# EAGLE design lpc812_breakout (EAGLE 7.1.0)
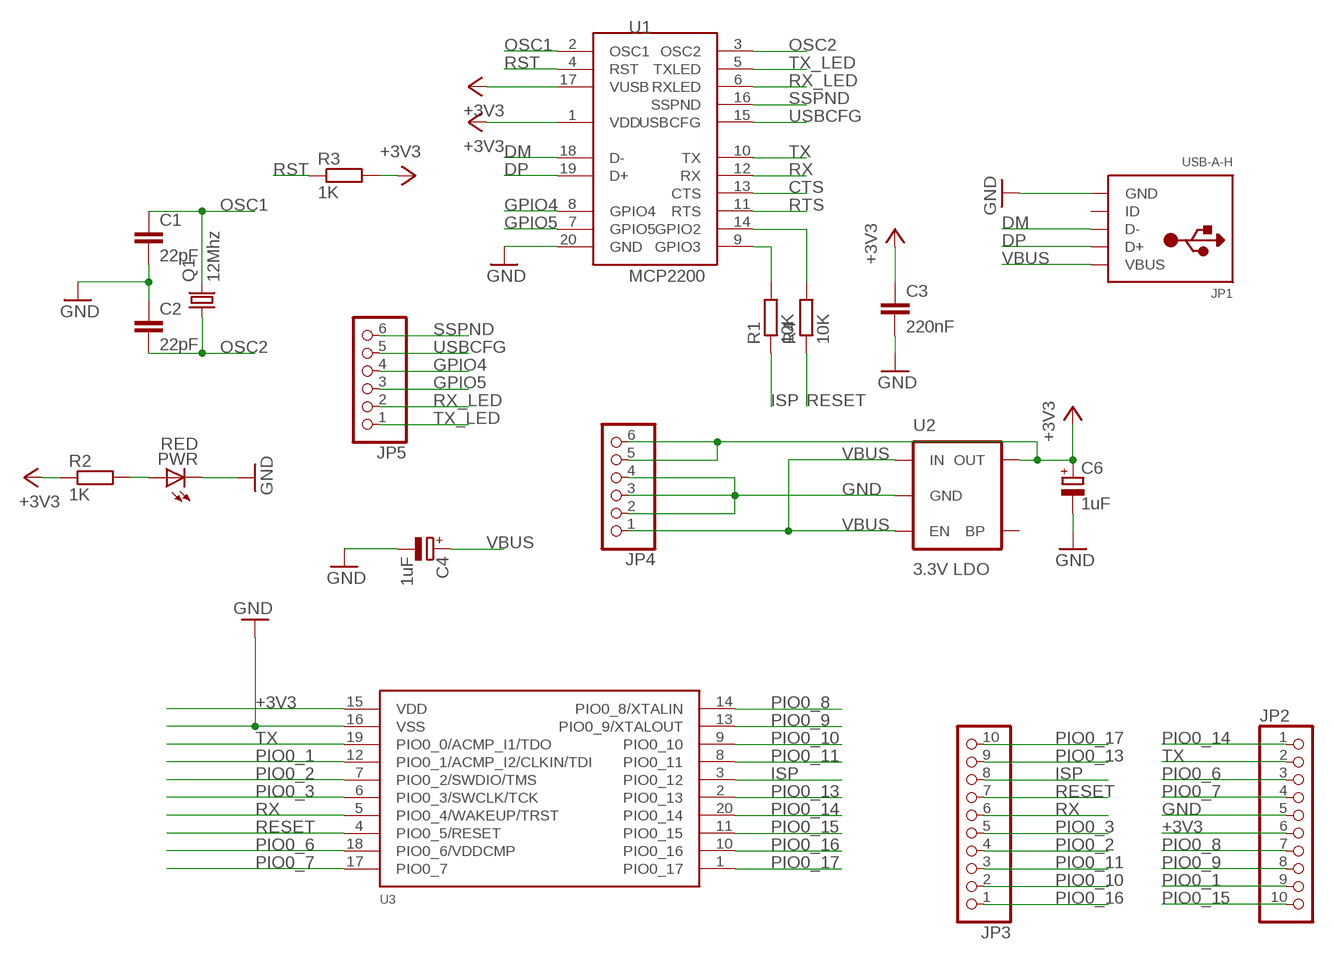
[diagram p0: schematic, sheet 1]

## Parts
C1  22pF  C-EUC1206  [C1206]
C2  22pF  C-EUC1206  [C1206]
C3  220nF  C-EUC1206  [C1206]
C4  1uF  CPOL-EUA/3216-18R  [A/3216-18R]
C6  1uF  CPOL-EUA/3216-18R  [A/3216-18R]
JP1  USB-A-H  USBMOLEX  [USB-MINIB-THM-MOLEX]
JP2  HEADER-1X10ROUND  [1X10_ROUND]
JP3  HEADER-1X10ROUND  [1X10_ROUND]
JP4  HEADER-1X6ROUND  [1X06_ROUND]
JP5  HEADER-1X6ROUND  [1X06_ROUND]
PWR  RED  LEDSMT1206  [1206]
Q1  12Mhz  CRYSTALHC49S  [HC49/S]
R1  10K  R-EU_R1206  [R1206]
R2  1K  R-EU_R1206  [R1206]
R3  1K  R-EU_R1206  [R1206]
R4  10K  R-EU_R1206  [R1206]
U1  MCP2200  [SSOP20]
U2  3.3V LDO  V_REG_LDOSMD  [SOT23-5]
U3  LPC812M101JDH20  [TSSOP20]

## Nets
+3V3: C3.1 C6.+ JP2.6 JP4.5 JP4.6 R2.1 R3.2 U1.1(VDD) U1.17(VUSB) U2.5(OUT) U3.15(VDD)
CTS: U1.13(CTS)
DM: JP1.D- U1.18(D-)
DP: JP1.D+ U1.19(D+)
GND [ground]: C1.2 C2.1 C3.2 C4.- C6.- JP1.GND JP2.5 JP4.2 JP4.3 JP4.4 PWR.C U1.20(GND) U2.2(GND) U3.16(VSS)
GPIO4: JP5.4 U1.8(GPIO4)
GPIO5: JP5.3 U1.7(GPIO5)
ISP: JP3.8 R1.1 U3.3(PIO0_12)
N$1: PWR.A R2.2
N$2: R1.2 U1.9(GPIO3)
N$3: R4.2 U1.14(GPIO2)
OSC1: C1.1 Q1.2 U1.2(OSC1)
OSC2: C2.2 Q1.1 U1.3(OSC2)
PIO0_1: JP2.9 U3.12(PIO0_1/ACMP_I2/CLKIN/TDI)
PIO0_2: JP3.4 U3.7(PIO0_2/SWDIO/TMS)
PIO0_3: JP3.5 U3.6(PIO0_3/SWCLK/TCK)
PIO0_6: JP2.3 U3.18(PIO0_6/VDDCMP)
PIO0_7: JP2.4 U3.17(PIO0_7)
PIO0_8: JP2.7 U3.14(PIO0_8/XTALIN)
PIO0_9: JP2.8 U3.13(PIO0_9/XTALOUT)
PIO0_10: JP3.2 U3.9(PIO0_10)
PIO0_11: JP3.3 U3.8(PIO0_11)
PIO0_13: JP3.9 U3.2(PIO0_13)
PIO0_14: JP2.1 U3.20(PIO0_14)
PIO0_15: JP2.10 U3.11(PIO0_15)
PIO0_16: JP3.1 U3.10(PIO0_16)
PIO0_17: JP3.10 U3.1(PIO0_17)
RESET: JP3.7 R4.1 U3.4(PIO0_5/RESET)
RST: R3.1 U1.4(RST)
RTS: U1.11(RTS)
RX: JP3.6 U1.12(RX) U3.5(PIO0_4/WAKEUP/TRST)
RX_LED: JP5.2 U1.6(RXLED)
SSPND: JP5.6 U1.16(SSPND)
TX: JP2.2 U1.10(TX) U3.19(PIO0_0/ACMP_I1/TDO)
TX_LED: JP5.1 U1.5(TXLED)
USBCFG: JP5.5 U1.15(USBCFG)
VBUS: C4.+ JP1.VBUS JP4.1 U2.1(IN) U2.3(EN)
Unconnected: JP1.ID U2.4(BP)

## Library data of the parts
C1-C3 = rcl:C-EU: CAPACITOR, European symbol
C4 C6 = rcl:CPOL-EU: POLARIZED CAPACITOR, European symbol
JP1 = adafruit:USB: USB Connectors USBMINIB - Surface Mount Female Mini-B USB Connector 4UConnector: 06564 By microbuilder.eu Thru-hole RA Female Mini-B USB Connector 4UConnector: 18732 By ladyada.net
JP2 JP3 = microbuilder:HEADER-1X10: PIN HEADER
JP4 JP5 = microbuilder:HEADER-1X6: PIN HEADER
PWR = led:LED: LED OSRAM: - CHIPLED LG R971, LG N971, LY N971, LG Q971, LY Q971, LO R971, LY R971 LH N974, LH R974 LS Q976, LO Q976, LY Q976 LO Q996 - Hyper CHIPLED LW Q18S LB Q993, LB Q99A, LB R99A - SideLED LS A670, LO A670, LY A670, LG A670, LP A670 LB A673, LV A673, LT A673, LW A673 LH A674 LY A675 LS A676, LA A676, LO A676, LY A676, LW A676 LS A679, LY A679, LG A679 - Hyper Micro SIDELED® LS Y876, LA Y876, LO Y876, LY Y876 LT Y87S - SmartLED LW L88C, LW L88S LB L89C, LB L89S, LG L890 LS L89K, LO L89K, LY L89K LS L896, LA L896, LO L896, LY L896 - TOPLED LS T670, LO T670, LY T670, LG T670, LP T670 LSG T670, LSP T670, LSY T670, LOP T670, LYG T670 LG T671, LOG T671, LSG T671 LB T673, LV T673, LT T673, LW T673 LH T674 LS T676, LA T676, LO T676, LY T676, LB T676, LH T676, LSB T676, LW T676 LB T67C, LV T67C, LT T67C, LS T67K, LO T67K, LY T67K, LW E67C LS E67B, LA E67B, LO E67B, LY E67B, LB E67C, LV E67C, LT E67C LW T67C LS T679, LY T679, LG T679 LS T770, LO T770, LY T770, LG T770, LP T770 LB T773, LV T773, LT T773, LW T773 LH T774 LS E675, LA E675, LY E675, LS T675 LS T776, LA T776, LO T776, LY T776, LB T776 LHGB T686 LT T68C, LB T68C - Hyper Mini TOPLED® LB M676 - Mini TOPLED Santana® LG M470 LS M47K, LO M47K, LY M47K Source: http://www.osram.convergy.de LUXEON: - LUMILED® LXK2-PW12-R00, LXK2-PW12-S00, LXK2-PW14-U00, LXK2-PW14-V00 LXK2-PM12-R00, LXK2-PM12-S00, LXK2-PM14-U00 LXK2-PE12-Q00, LXK2-PE12-R00, LXK2-PE12-S00, LXK2-PE14-T00, LXK2-PE14-U00 LXK2-PB12-K00, LXK2-PB12-L00, LXK2-PB12-M00, LXK2-PB14-N00, LXK2-PB14-P00, LXK2-PB14-Q00 LXK2-PR12-L00, LXK2-PR12-M00, LXK2-PR14-Q00, LXK2-PR14-R00 LXK2-PD12-Q00, LXK2-PD12-R00, LXK2-PD12-S00 LXK2-PH12-R00, LXK2-PH12-S00 LXK2-PL12-P00, LXK2-PL12-Q00, LXK2-PL12-R00 Source: www.luxeon.com KINGBRIGHT: KA-3528ASYC Source: www.kingbright.com
Q1 = adafruit:CRYSTAL: CRYSTAL; OC_FARNELL: 1667008; OC_NEWARK: unknown
R1-R4 = rcl:R-EU_: RESISTOR, European symbol
U1 = microchip-update:MCP2200: USB 2.0 to UART Protocol Converter with GPIO
U2 = SparkFun:V_REG_LDO: Voltage Regulator LDO Standard 150mA LDO voltage regulator in SOT-23 layout. Micrel part MIC5205. BP (by-pass) pin is used to lower output noise with 470pF cap.
U3 = LPC800:LPC812M101JDH20

## Net classes
0 default: width 0.305 mm, clearance 0.205 mm
1 ground: width 0.305 mm, clearance 0.205 mm to class 0, clearance 0.205 mm

## Board
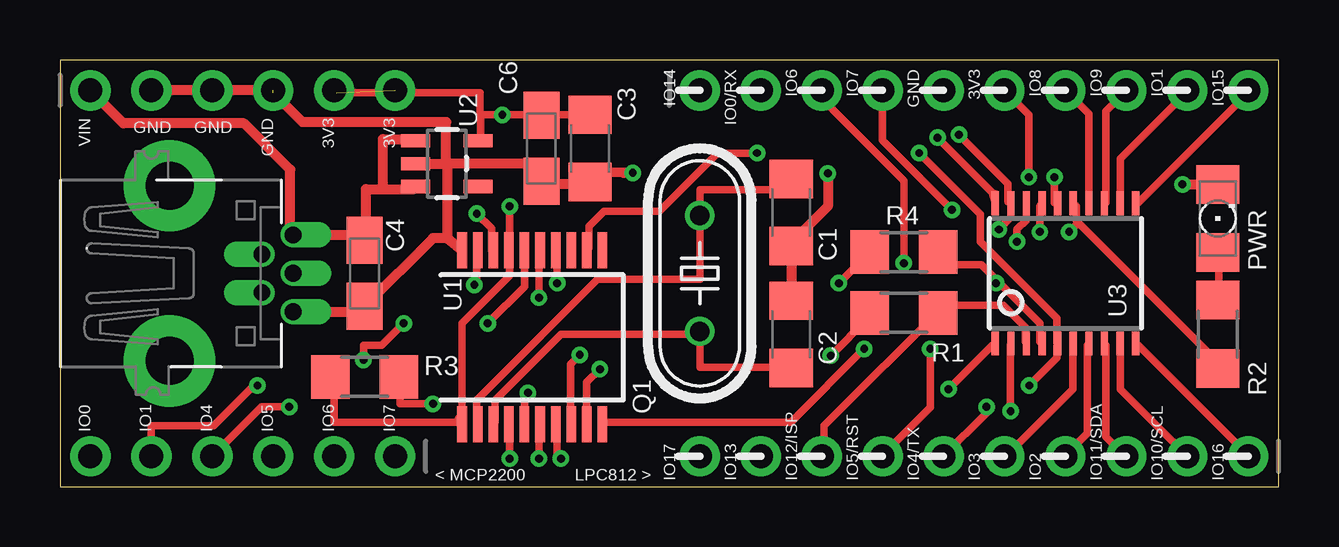
[diagram p1: board, top side]
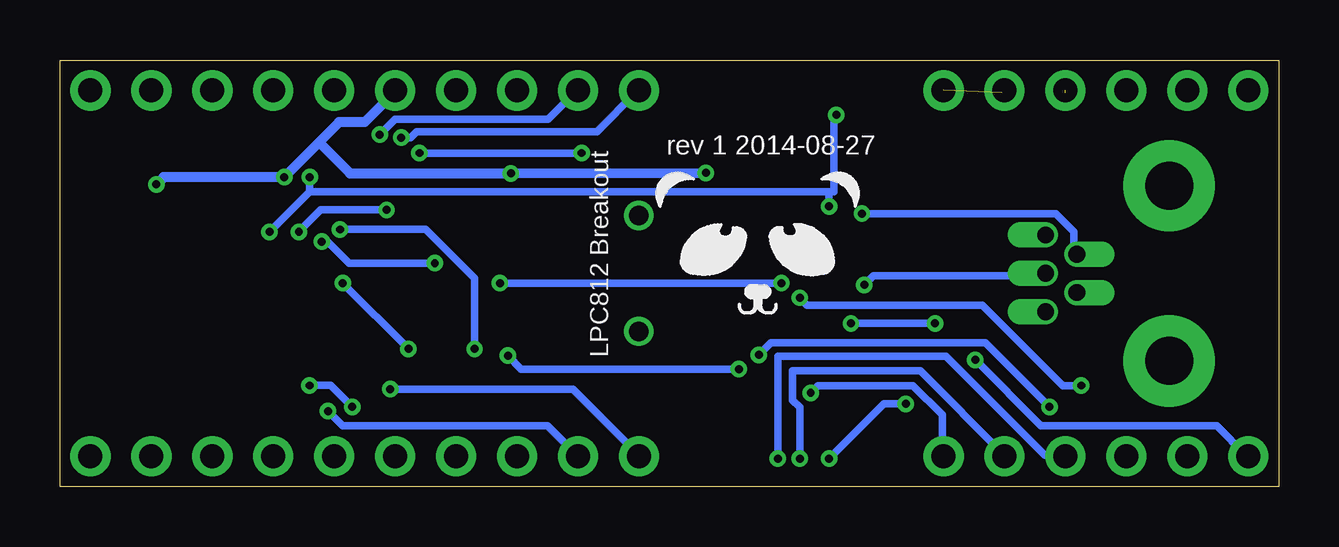
[diagram p2: board, bottom side, seen from below]

Size 50.8 x 17.78 mm. Coordinates in mm from the lower left corner, seen from the top.
Outline: 0,0 50.8,0 50.8,17.78 0,17.78 0,0
Copper layers (1*16): Top 0.0356mm / dielectric 1.5011mm / Bottom 0.0356mm
Design rules "LaenPCBOrder": minimum track width 6mil, minimum drill 13mil, track to track 6mil, track to pad 6mil, pad to pad 6mil, via to via 6mil, smd to smd 6mil, copper to edge 15mil, drill to drill 6mil, minimum pad ring 7mil, minimum via ring 7mil, stop-mask expansion 3mil, vias tented up to drill 0mil, thermal gap 10mil
tRestrict: area -1.3,-5.7 to 3.8,14; area 27.2,18.1 to 48.8,20; area 27.6,-4.9 to 49.8,-0.5; area 27.6,-4.9 to 49.8,-0.5; area 27.6,-4.9 to 49.8,-0.5; area -6.7,-4.9 to 15.5,-0.5; area 5.1,7.6 to 7,10.2; area 5.1,7.6 to 7,10.2
bRestrict: area 0,-4.7 to 3.8,14; area 27.6,-4.9 to 49.8,-0.5; area 27.2,18.1 to 48.8,20; area -6.6,-4.9 to 15.7,-0.5; area 5.1,7.6 to 7,10.2

### Footprints (pad centres in the part's own frame; a part is rotated, then mirrored left to right if it is on the bottom)
C1206 = smd 1.6 x 1.8: 1 -1.4,0; 2 1.4,0
A/3216-18R = smd 1.95 x 1.5: + 1.375,0; - -1.375,0
USB-MINIB-THM-MOLEX = drill 0.7 offset: D+ 0,9.72; D- -0.8,8.42; GND 1.6,9.72; ID 0.8,8.42; VBUS -1.6,9.72 | drill 2 pad 3.81: GND1 -3.65,4.57; GND4 3.65,4.57
1X10_ROUND = drill 1 pad 1.676: 1 -11.43,0; 2 -8.89,0; 3 -6.35,0; 4 -3.81,0; 5 -1.27,0; 6 1.27,0; 7 3.81,0; 8 6.35,0; 9 8.89,0; 10 11.43,0
1X06_ROUND = drill 1 pad 1.676: 1 -6.35,0; 2 -3.81,0; 3 -1.27,0; 4 1.27,0; 5 3.81,0; 6 6.35,0
1206 = smd 1.6 x 1.803: A -1.422,0; C 1.422,0
HC49/S = drill 0.813: 1 -2.413,0; 2 2.413,0
R1206 = smd 1.6 x 1.803: 1 -1.422,0; 2 1.422,0
SSOP20 = smd 0.4 x 1.5: 1 -2.925,-3.625; 2 -2.275,-3.625; 3 -1.625,-3.625; 4 -0.975,-3.625; 5 -0.325,-3.625; 6 0.325,-3.625; 7 0.975,-3.625; 8 1.625,-3.625; 9 2.275,-3.625; 10 2.925,-3.625; 11 2.925,3.625; 12 2.275,3.625; 13 1.625,3.625; 14 0.975,3.625; 15 0.325,3.625; 16 -0.325,3.625; 17 -0.975,3.625; 18 -1.625,3.625; 19 -2.275,3.625; 20 -2.925,3.625
SOT23-5 = smd 0.55 x 1.2: 1 -0.95,-1.3; 2 0,-1.3; 3 0.95,-1.3; 4 0.95,1.3; 5 -0.95,1.3
TSSOP20 = smd 0.305 x 0.991: 1 -2.925,-2.918; 2 -2.275,-2.918; 3 -1.625,-2.918; 4 -0.975,-2.918; 5 -0.325,-2.918; 6 0.325,-2.918; 7 0.975,-2.918; 8 1.625,-2.918; 9 2.275,-2.918; 10 2.925,-2.918; 11 2.925,2.918; 12 2.275,2.918; 13 1.625,2.918; 14 0.975,2.918; 15 0.325,2.918; 16 -0.325,2.918; 17 -0.975,2.918; 18 -1.625,2.918; 19 -2.275,2.918; 20 -2.925,2.918

### Placement (x,y rotation side)
C1  30.48,11.43 270 top
C2  30.48,6.35 270 top
C3  22.1,14.1 270 top
C4  12.7,8.89 90 top
C6  20.07,14.1 90 top
JP1  0,8.89 270 top
JP2  38.1,16.51 0 top
JP3  38.1,1.27 180 top
JP4  7.62,16.51 0 top
JP5  7.62,1.27 180 top
PWR  48.26,11.18 90 top
Q1  26.67,8.89 90 top
R1  35.18,7.24 180 top
R2  48.26,6.35 90 top
R3  12.7,4.57 180 top
R4  35.18,9.78 180 top
U1  19.68,6.22 0 top
U2  16.13,13.46 270 top
U3  41.91,8.89 0 top
U$1  [PANDA]  21.72,9.27 0 bottom

### Tracks (layer width: path | path; a pad name or v marks a point on that pad's centre or on a via)
+3V3  (via drill 0.33)  (1 unrouted)
  Top 0.305: 48.16,4.98 R2.1 48.16,5.13 48.16,5.28 42.44,11 | U3.15 42.37,11.68 42.37,11.07 42.44,11 | 17.53,15.49 17.5,15.49 17.5,16.41 11.53,16.41 JP4.5 | 17.53,15.49 v18.44,15.49 | v18.44,15.49 | v18.44,15.49 19.96,15.49 C6.+ 20.12,15.49 C3.1 | JP2.6 40.39,15.49 v40.39,12.9 | v42.06,10.62 42.44,11 | R3.2 11.43,4.52 11.43,2.69 16.61,2.69 U1.1 16.61,2.85 16.76,3 16.76,6.81 18.75,8.79 18.75,9.7 U1.17 18.75,9.86 v18.75,11.68 | 17.53,15.49 17.53,14.43 U2.5
  Bottom 0.305: v18.44,15.49 18.59,15.49 18.54,15.37 18.54,12.29 18.75,12.29 | 40.39,12.29 v40.39,12.9 | 18.75,12.29 40.39,12.29 | 40.39,12.29 v42.06,10.62 | 18.75,12.29 v18.75,11.68
DM  (via drill 0.33)
  Top 0.305: v17.37,11.38 17.98,10.77 17.98,9.86 U1.18
  Bottom 0.305: v17.37,11.38 9.3,11.38 8.53,10.62 8.53,9.7 JP1.D-
DP  (via drill 0.33)
  Top 0.305: 17.27,8.64 v17.27,8.41 17.37,8.64 17.37,9.7 U1.19
  Bottom 0.305: v17.27,8.41 16.89,8.79 9.75,8.79 JP1.D+
GND  (via drill 0.33)  (1 unrouted)
  Top 0.305: 30.48,10.16 C1.2 | 12.8,7.57 C4.- 12.8,7.72 12.93,8 | 15.04,13.44 U2.2 14.94,13.44 | 30.63,10.16 C1.2 | 20.12,12.6 C6.- | 30.63,10.31 C1.2 | v41.45,12.9 41.45,11.84 U3.16 | 48.16,12.6 PWR.C
  Top 0.406: JP1.GND 12.47,7.29 C4.- 15.55,10.36 16.15,10.36 | 22.1,12.6 22.15,13.11 23.5,13.08 v23.88,13.08 | C1.2 C2.1 | 22.1,12.6 20.12,12.6 | 22.1,12.6 C3.2 | 30.63,10.31 32,11.68 v32,13.06 | v46.79,12.6 48.16,12.6 | 16.15,13.44 16.1,13.44 | 16.1,13.44 15.04,13.44 14.94,13.44 | 16.15,10.36 16.15,13.44 | 16.15,13.44 16.28,13.46 19.46,13.46 C6.- | 16.15,10.36 U1.20 | 8.89,16.41 10.11,15.19 16.1,15.19 16.1,13.44 | JP4.4 JP4.3 JP4.2
  Bottom 0.305: v32,13.06 | 36.88,16.41 JP2.5
  Bottom 0.406: v23.88,13.08 v32,13.06 32.54,13.06 38.71,13.06 40.01,14.35 | 40.01,14.35 39.17,15.19 38.1,15.19 36.88,16.41 | 40.01,14.35 v41.45,12.9 46.48,12.9 v46.79,12.6
GPIO4  (via drill 0.33)
  Top 0.305: v21.67,5.49 21.28,5.11 21.28,2.69 U1.8 | v9.56,3.33 8.41,3.33 6.37,1.29 JP5.4
  Bottom 0.305: v21.67,5.49 21.16,6 12.23,6 v9.56,3.33
GPIO5  (via drill 0.33)
  Top 0.305: v20.88,1.17 20.73,1.32 20.73,2.54 U1.7
  Bottom 0.305: v20.88,1.17 20.88,5.44 13.87,5.44 9.75,1.32 8.99,1.32 JP5.3
ISP
  Top 0.305: U3.3 40.23,6.05 40.23,6.66 39.32,7.57 37.03,7.57 R1.1 36.88,7.57 31.85,2.54 31.85,1.32 JP3.8
N$1
  Top 0.305: R2.2 48.31,7.87 48.31,10.01 PWR.A
N$2  (via drill 0.33)
  Top 0.305: 34.14,7.57 R1.2 33.68,7.11 33.68,7.01 v32.13,5.46 | v22.5,4.9 21.95,4.34 21.95,2.69 U1.9
  Bottom 0.305: v22.5,4.9 31.57,4.9 v32.13,5.46
N$3  (via drill 0.33)
  Top 0.305: v20.73,8.48 20.73,9.7 U1.14 | v32.46,8.48 33.68,9.7 R4.2
  Bottom 0.305: v32.46,8.48 v20.73,8.48
OSC1
  Top 0.305: C1.1 30.48,12.37 26.67,12.37 Q1.2 26.67,8.64 22.4,8.64 17.37,3.61 17.37,2.69 U1.2
OSC2
  Top 0.305: 26.67,6.35 20.88,6.35 18.14,3.61 18.14,2.69 U1.3 | 26.67,6.35 26.67,4.98 30.48,4.98 C2.2 | 26.67,6.35 Q1.1
PIO0_1
  Top 0.305: U3.12 44.2,11.84 44.2,13.66 46.94,16.41 JP2.9
PIO0_2
  Top 0.305: U3.7 42.82,5.89 42.82,2.23 41.91,1.32 JP3.4
PIO0_3
  Top 0.305: U3.6 42.22,5.89 42.22,4.06 39.47,1.32 JP3.5
PIO0_6  (via drill 0.33)
  Top 0.305: v39.89,10.21 39.89,10.72 40.27,11.1 40.27,11.74 U3.18 | v35.18,9.32 35.18,12.76 31.86,16.07 31.86,16.45 JP2.3
  Bottom 0.305: v39.89,10.21 39.64,10.21 38.74,9.32 v35.18,9.32
PIO0_7  (via drill 0.33)
  Top 0.305: v40.84,10.62 40.84,11.68 U3.17 | v37.19,11.53 34.29,14.43 JP2.4
  Bottom 0.305: v40.84,10.62 39.93,11.53 v37.19,11.53
PIO0_8
  Top 0.305: U3.14 42.88,15.54 JP2.7
PIO0_9
  Top 0.305: JP2.8 43.59,15.65 43.59,11.84 U3.13
PIO0_10
  Top 0.305: JP3.2 44.2,4.06 44.2,5.89 U3.9
PIO0_11
  Top 0.305: U3.8 43.59,5.89 43.59,2.08 44.35,1.32 JP3.3
PIO0_13  (via drill 0.33)
  Top 0.305: v39.62,3.15 39.62,5.89 U3.2
  Bottom 0.305: v39.62,3.15 39.01,2.54 30.48,2.54 JP3.9
PIO0_14  (via drill 0.33)
  Top 0.305: 38.99,12.22 U3.20 38.87,12.25 v36.58,14.54
  Bottom 0.305: v36.58,14.54 36.2,14.54 35.94,14.8 28.42,14.8 26.77,16.45 JP2.1
PIO0_15
  Top 0.305: U3.11 44.96,11.84 49.53,16.41 JP2.10
PIO0_16
  Top 0.305: U3.10 44.96,5.89 49.53,1.32 JP3.1
PIO0_17  (via drill 0.33)
  Top 0.305: v37.03,4.06 38.86,5.89 U3.1
  Bottom 0.305: v37.03,4.06 29.41,4.06 26.67,1.32 JP3.10
RESET  (via drill 0.33)
  Top 0.305: 39.09,8.56 38.41,9.25 36.73,9.25 36.73,9.7 R4.1 | 39.09,8.56 40.84,6.81 40.84,6.05 U3.4 | v36.27,5.74 36.27,3.3 34.29,1.32 JP3.7 | v39.01,8.48 39.09,8.56
  Bottom 0.305: v39.01,8.48 v36.27,5.74
RST  (via drill 0.33)
  Top 0.305: v18.75,1.17 18.75,2.54 U1.4 | v15.54,3.45 14.17,3.45 14.17,4.52 R3.1
  Bottom 0.305: v18.75,1.17 16.46,3.45 v15.54,3.45
RX  (via drill 0.33)
  Top 0.305: v40.4,4.22 41.55,5.37 41.55,5.88 U3.5 41.55,6 41.55,7.02 38.36,10.21 38.36,11.36 v35.81,13.9 | v38.62,3.33 38.62,3.07 36.83,1.29 JP3.6 | v29.06,13.9 27.4,13.9 24.98,11.48 22.69,11.48 22.05,10.85 22.05,9.95 U1.12
  Bottom 0.305: v40.4,4.22 39.51,4.22 v38.62,3.33 | v35.81,13.9 v29.06,13.9
RX_LED  (via drill 0.33)
  Top 0.305: v19.96,1.17 19.96,2.54 U1.6
  Bottom 0.305: v19.96,1.17 19.96,3.3 20.27,3.61 20.27,4.83 14.94,4.83 11.43,1.32 JP5.2
SSPND  (via drill 0.33)
  Top 0.305: v17.83,6.81 19.36,8.33 19.36,9.7 U1.16 | v14.33,6.81 13.41,5.89 12.65,5.89 v12.65,5.28
  Bottom 0.305: v14.33,6.81 v17.83,6.81 | v12.65,5.28 9.91,2.54 2.59,2.54 1.37,1.32 JP5.6
TX  (via drill 0.33)
  Top 0.305: v37.47,14.67 39.51,12.63 39.51,11.87 U3.19 39.64,11.74 39.64,11.23 v39.13,10.72 | v33.52,5.75 30.46,2.69 22.69,2.69 U1.10
  Bottom 0.305: v37.47,14.67 36.83,15.31 30.46,15.31 29.31,16.45 JP2.2 | v33.52,5.75 33.52,8.68 35.56,10.72 v39.13,10.72
TX_LED  (via drill 0.33)
  Top 0.305: v19.51,3.91 19.36,3.76 19.36,2.69 U1.5
  Bottom 0.305: v19.51,3.91 19.2,4.22 15.24,4.22 14.02,3 14.02,1.32 JP5.1
USBCFG  (via drill 0.33)
  Top 0.305: v19.96,7.87 19.96,9.7 U1.15 | JP5.5 3.81,2.54 6.4,2.54 8.08,4.22 v8.23,4.22
  Bottom 0.305: v19.96,7.87 19.66,7.57 12.34,7.57 8.99,4.22 v8.23,4.22
VBUS
  Top 0.305: 12.5,10.62 C4.+ 12.75,10.64 | 14.76,12.4 U2.3 | 14.76,14.48 U2.1
  Top 0.406: C4.+ 12.47,10.49 JP1.VBUS 9.6,10.62 9.6,13.21 7.67,15.14 2.64,15.14 JP4.1 | 13.46,12.4 12.75,12.4 12.75,10.64 | 13.46,12.4 14.76,12.4 | 14.76,14.48 13.46,14.48 13.46,12.4

### Text on the board
bPlace: LPC812 Breakout
tNames: IO14 | IO0/RX | IO6 | IO7 | GND | 3V3 | IO8 | IO9 | IO1 | IO15 | VIN | GND | GND | GND | 3V3 | 3V3 | IO0 | IO1 | IO4 | IO5 | IO6 | IO7 | < MCP2200 | LPC812 > | IO17 | IO13 | IO12/ISP | IO5/RST | IO4/TX | IO3 | IO2 | IO11/SDA | IO10/SCL | IO16
bNames: rev 1 2014-08-27